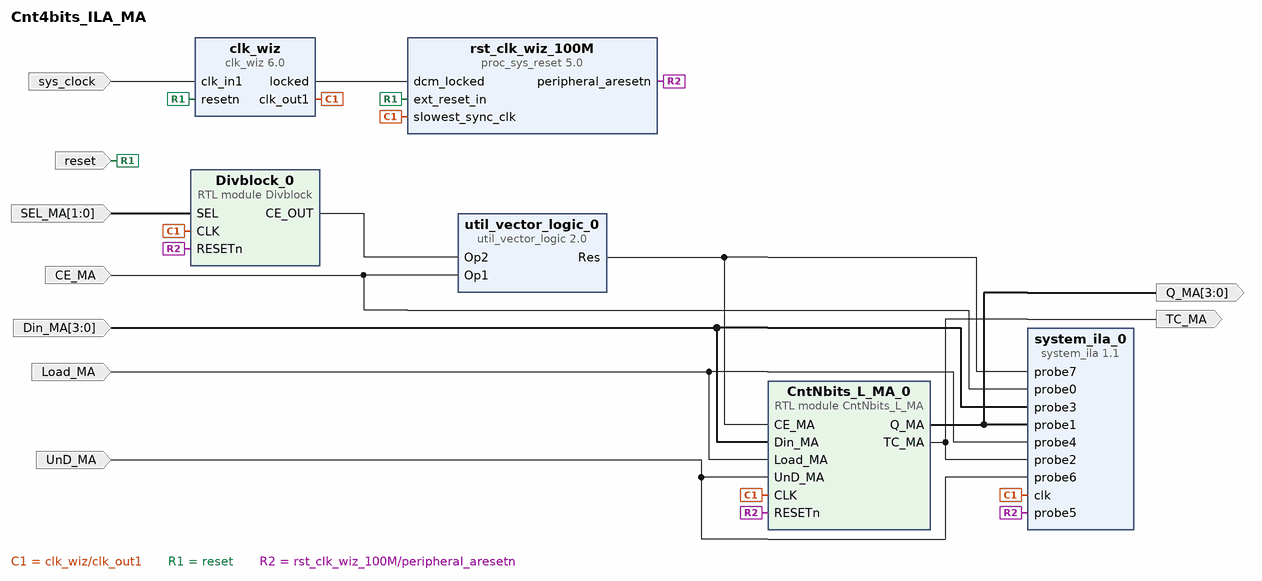
[diagram p0: block diagram of the top level]
# Vivado block design Cnt4bits_ILA_MA, xc7a100tcsg324-1, Vivado 2024.1
create_bd_design Cnt4bits_ILA_MA

create_bd_port -dir I -type clk sys_clock
set_property -dict {CONFIG.FREQ_HZ 100000000 CONFIG.PHASE 0.0} [get_bd_ports sys_clock]
create_bd_port -dir I -type rst reset
set_property -dict {CONFIG.POLARITY ACTIVE_LOW} [get_bd_ports reset]
create_bd_port -dir I Load_MA
create_bd_port -dir I UnD_MA
create_bd_port -dir I CE_MA
create_bd_port -dir I -from 3 -to 0 Din_MA
create_bd_port -dir O -from 3 -to 0 Q_MA
create_bd_port -dir O TC_MA
create_bd_port -dir I -from 1 -to 0 SEL_MA

create_bd_cell -type ip -vlnv xilinx.com:ip:clk_wiz:6.0 clk_wiz
set_property -dict [list \
  CONFIG.CLKOUT1_REQUESTED_OUT_FREQ 100 \
  CONFIG.CLK_IN1_BOARD_INTERFACE sys_clock \
  CONFIG.RESET_BOARD_INTERFACE reset \
  CONFIG.RESET_PORT resetn \
  CONFIG.RESET_TYPE ACTIVE_LOW \
  CONFIG.USE_BOARD_FLOW true \
] [get_bd_cells clk_wiz]
create_bd_cell -type ip -vlnv xilinx.com:ip:proc_sys_reset:5.0 rst_clk_wiz_100M
set_property -dict {CONFIG.RESET_BOARD_INTERFACE reset CONFIG.USE_BOARD_FLOW true} [get_bd_cells rst_clk_wiz_100M]
create_bd_cell -type ip -vlnv xilinx.com:ip:system_ila:1.1 system_ila_0
set_property -dict [list \
  CONFIG.C_MON_TYPE NATIVE \
  CONFIG.C_NUM_OF_PROBES 8 \
  CONFIG.C_PROBE0_TYPE 0 \
  CONFIG.C_PROBE1_TYPE 0 \
  CONFIG.C_PROBE2_TYPE 0 \
  CONFIG.C_PROBE3_TYPE 0 \
  CONFIG.C_PROBE4_TYPE 0 \
  CONFIG.C_PROBE5_TYPE 0 \
  CONFIG.C_PROBE6_TYPE 0 \
] [get_bd_cells system_ila_0]
create_bd_cell -type module -reference CntNbits_L_MA CntNbits_L_MA_0
create_bd_cell -type module -reference Divblock Divblock_0
set_property -dict {CONFIG.DIV_RATE1 8 CONFIG.DIV_RATE2 20000000 CONFIG.DIV_RATE3 100000000} [get_bd_cells Divblock_0]
create_bd_cell -type ip -vlnv xilinx.com:ip:util_vector_logic:2.0 util_vector_logic_0
set_property -dict {CONFIG.C_SIZE 1} [get_bd_cells util_vector_logic_0]

# ---- connections ----

connect_bd_net -net CE_CNT_MA [get_bd_pins util_vector_logic_0/Res] [get_bd_pins CntNbits_L_MA_0/CE_MA] [get_bd_pins system_ila_0/probe7]
connect_bd_net -net CE_MelnicAnastasia_0_1 [get_bd_ports CE_MA] [get_bd_pins system_ila_0/probe0] [get_bd_pins util_vector_logic_0/Op1]
connect_bd_net [get_bd_pins CntNbits_L_MA_0/Q_MA] [get_bd_pins system_ila_0/probe1] [get_bd_ports Q_MA]
connect_bd_net [get_bd_pins CntNbits_L_MA_0/TC_MA] [get_bd_pins system_ila_0/probe2] [get_bd_ports TC_MA]
connect_bd_net -net Din_MelnicAnastasia_0_1 [get_bd_ports Din_MA] [get_bd_pins system_ila_0/probe3] [get_bd_pins CntNbits_L_MA_0/Din_MA]
connect_bd_net [get_bd_pins Divblock_0/CE_OUT] [get_bd_pins util_vector_logic_0/Op2]
connect_bd_net -net Load_MelnicAnastasia_0_1 [get_bd_ports Load_MA] [get_bd_pins system_ila_0/probe4] [get_bd_pins CntNbits_L_MA_0/Load_MA]
connect_bd_net -net SEL_0_1 [get_bd_ports SEL_MA] [get_bd_pins Divblock_0/SEL]
connect_bd_net -net UnD_MelnicAnastasia_0_1 [get_bd_ports UnD_MA] [get_bd_pins system_ila_0/probe6] [get_bd_pins CntNbits_L_MA_0/UnD_MA]
connect_bd_net [get_bd_pins clk_wiz/clk_out1] \
  [get_bd_pins rst_clk_wiz_100M/slowest_sync_clk] [get_bd_pins system_ila_0/clk] [get_bd_pins CntNbits_L_MA_0/CLK] \
  [get_bd_pins Divblock_0/CLK]
connect_bd_net [get_bd_pins clk_wiz/locked] [get_bd_pins rst_clk_wiz_100M/dcm_locked]
connect_bd_net [get_bd_ports reset] [get_bd_pins clk_wiz/resetn] [get_bd_pins rst_clk_wiz_100M/ext_reset_in]
connect_bd_net -net rst_clk_wiz_100M_peripheral_aresetn [get_bd_pins rst_clk_wiz_100M/peripheral_aresetn] \
  [get_bd_pins system_ila_0/probe5] [get_bd_pins CntNbits_L_MA_0/RESETn] [get_bd_pins Divblock_0/RESETn]
connect_bd_net [get_bd_ports sys_clock] [get_bd_pins clk_wiz/clk_in1]
set_property HDL_ATTRIBUTE.DEBUG true [get_bd_nets CE_MelnicAnastasia_0_1]
set_property HDL_ATTRIBUTE.MARK_DEBUG true [get_bd_nets CE_MelnicAnastasia_0_1]
set_property HDL_ATTRIBUTE.DEBUG true [get_bd_nets Din_MelnicAnastasia_0_1]
set_property HDL_ATTRIBUTE.MARK_DEBUG true [get_bd_nets Din_MelnicAnastasia_0_1]
set_property HDL_ATTRIBUTE.DEBUG true [get_bd_nets Load_MelnicAnastasia_0_1]
set_property HDL_ATTRIBUTE.MARK_DEBUG true [get_bd_nets Load_MelnicAnastasia_0_1]
set_property HDL_ATTRIBUTE.DEBUG true [get_bd_nets UnD_MelnicAnastasia_0_1]
set_property HDL_ATTRIBUTE.MARK_DEBUG true [get_bd_nets UnD_MelnicAnastasia_0_1]
set_property HDL_ATTRIBUTE.DEBUG true [get_bd_nets rst_clk_wiz_100M_peripheral_aresetn]
set_property HDL_ATTRIBUTE.MARK_DEBUG true [get_bd_nets rst_clk_wiz_100M_peripheral_aresetn]

validate_bd_design
save_bd_design
